# EAGLE design pololuLaserDrv (EAGLE 7.0.0)
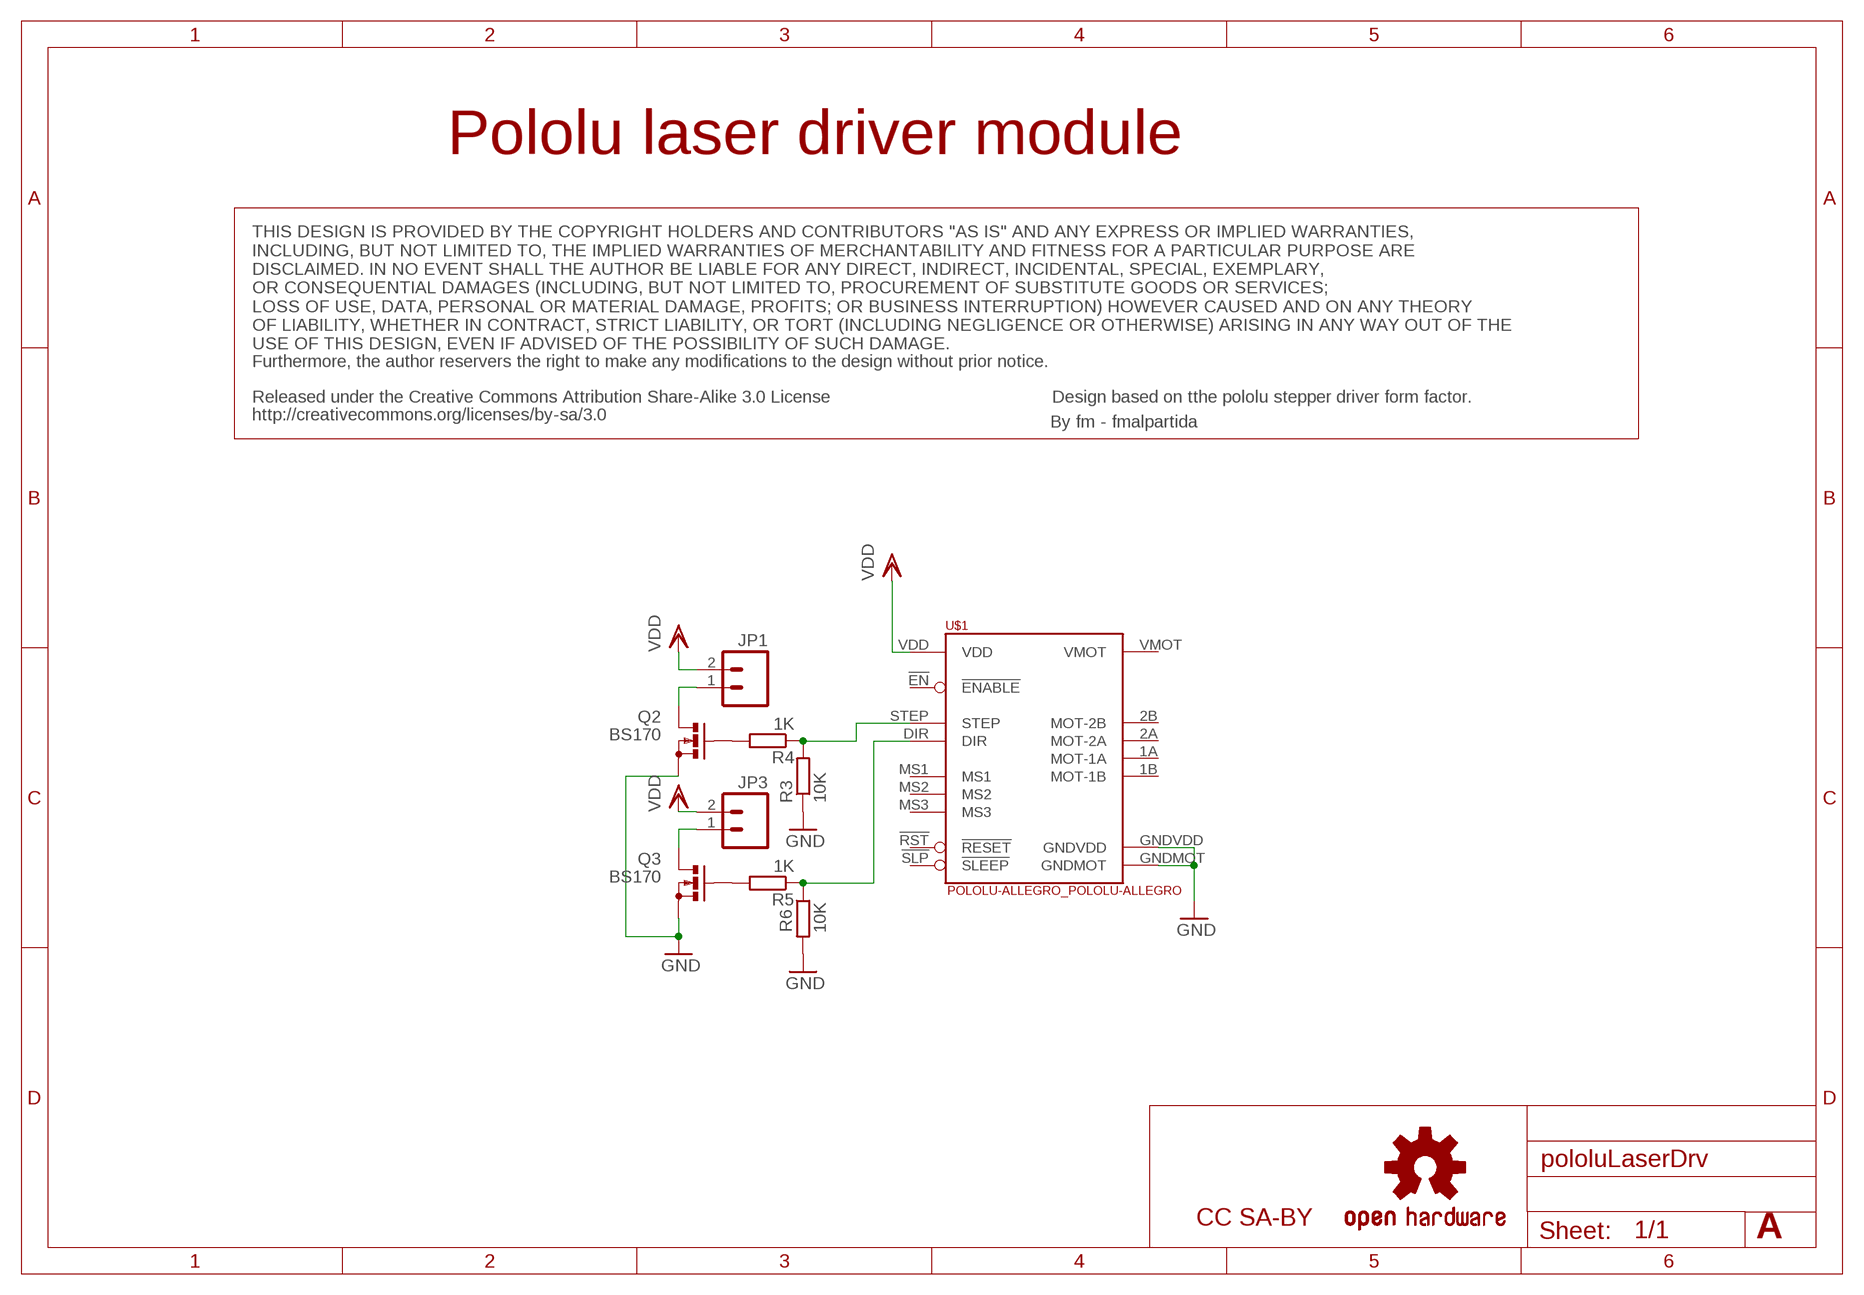
[diagram p0: schematic, sheet 1]

## Parts
JP1  M02PTH  [1X02]
JP3  M02PTH  [1X02]
Q2  BS170  [SOT54E]
Q3  BS170  [SOT54E]
R3  10K  R-EU_0204/5  [0204/5]
R4  1K  R-EU_0204/5  [0204/5]
R5  1K  R-EU_0204/5  [0204/5]
R6  10K  R-EU_0204/5  [0204/5]
U$1  POLOLU-ALLEGRO_POLOLU-ALLEGRO  [POLOLU-ALLEGRO_POLOLU-ALLEGRO-PTH]
U$2  OSHW-LOGOS  [OSHW-LOGO-S]

## Nets
GND: Q2.S Q3.S R3.1 R6.2 U$1.GNDMOT U$1.GNDVDD
N$4: Q2.G R4.2
N$5: R3.2 R4.1 U$1.STEP
N$6: Q3.G R5.2
N$7: R5.1 R6.1 U$1.DIR
N$9: JP1.1 Q2.D
N$10: JP3.1 Q3.D
VDD: JP1.2 JP3.2 U$1.VDD
Unconnected: U$1.!EN(!ENABLE) U$1.!RST(!RESET) U$1.!SLP(!SLEEP) U$1.MS1 U$1.MS2 U$1.MS3

## Notes on the sheet
- Pololu laser driver module
- THIS DESIGN IS PROVIDED BY THE COPYRIGHT HOLDERS AND CONTRIBUTORS "AS IS" AND ANY EXPRESS OR IMPLIED WARRANTIES, 
  INCLUDING, BUT NOT LIMITED TO, THE IMPLIED WARRANTIES OF MERCHANTABILITY AND FITNESS FOR A PARTICULAR PURPOSE ARE
  DISCLAIMED. IN NO EVENT SHALL THE AUTHOR BE LIABLE FOR ANY DIRECT, INDIRECT, INCIDENTAL, SPECIAL, EXEMPLARY, 
  OR CONSEQUENTIAL DAMAGES (INCLUDING, BUT NOT LIMITED TO, PROCUREMENT OF SUBSTITUTE GOODS OR SERVICES;
  LOSS OF USE, DATA, PERSONAL OR MATERIAL DAMAGE, PROFITS; OR BUSINESS INTERRUPTION) HOWEVER CAUSED AND ON ANY THEORY 
  OF LIABILITY, WHETHER IN CONTRACT, STRICT LIABILITY, OR TORT (INCLUDING NEGLIGENCE OR OTHERWISE) ARISING IN ANY WAY OUT OF THE 
  USE OF THIS DESIGN, EVEN IF ADVISED OF THE POSSIBILITY OF SUCH DAMAGE.
- Furthermore, the author reservers the right to make any modifications to the design without prior notice.
- Released under the Creative Commons Attribution Share-Alike 3.0 License | Design based on tthe pololu stepper driver form factor.
- http://creativecommons.org/licenses/by-sa/3.0
- By fm - fmalpartida
- CC SA-BY
- A

## Power pins joined to a net without a drawn wire
MOT-1A: U$1.1A(MOT-1A)
MOT-1B: U$1.1B(MOT-1B)
MOT-2A: U$1.2A(MOT-2A)
MOT-2B: U$1.2B(MOT-2B)
VMOT: U$1.VMOT

## Library data of the parts
JP1 JP3 = SparkFun:M02: Header 2 Standard 2-pin 0.1" header. Use with straight break away headers (SKU : PRT-00116), right angle break away headers (PRT-00553), swiss pins (PRT-00743), machine pins (PRT-00117), and female headers (PRT-00115). Molex polarized connector foot print use with SKU : PRT-08233 with associated crimp pins and housings.
Q2 Q3 = transistor-small-signal:BS170: N-CHANNEL MOS FET
R3-R6 = rcl:R-EU_: RESISTOR, European symbol
U$1 = SAVLibSAV MK-I:POLOLU-ALLEGRO_POLOLU-ALLEGRO
U$2 = SparkFun:OSHW-LOGO: Open Source Hardware Logo This logo indicates the piece of hardware it is found on incorporates a OSHW license and/or adheres to the definition of open source hardware found here: http://freedomdefined.org/OSHW

## Board
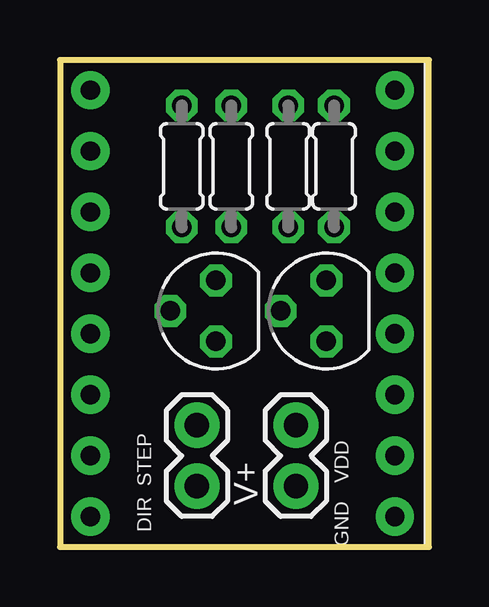
[diagram p1: board, top side]
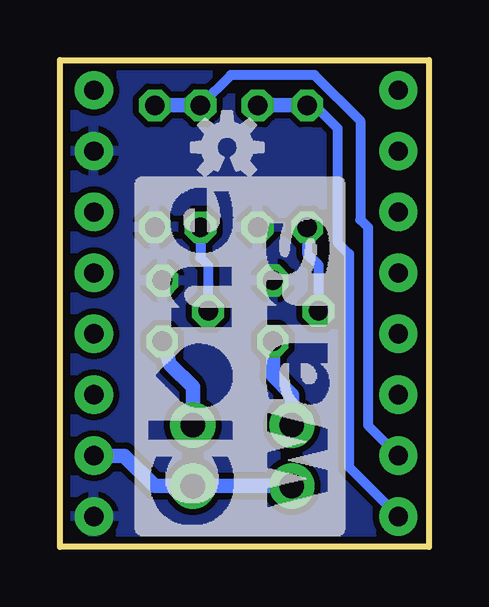
[diagram p2: board, bottom side, seen from below]

Size 15.39 x 20.31 mm. Coordinates in mm from the lower left corner, seen from the top.
Outline: 0,0 15.39,0 15.39,20.31 0,20.31 0,0
Copper layers (1*16): Top 0.035mm / dielectric 1.5mm / Bottom 0.035mm
Design rules "default *": minimum track width 10mil, minimum drill 24mil, track to track 10mil, track to pad 10mil, pad to pad 10mil, via to via 10mil, smd to smd 10mil, copper to edge 12mil, drill to drill 8mil, minimum pad ring 10mil, minimum via ring 8mil, stop-mask expansion 4mil, vias tented up to drill 0mil, thermal gap 10mil

### Footprints (pad centres in the part's own frame; a part is rotated, then mirrored left to right if it is on the bottom)
1X02 = drill 1.016 pad 1.88: 1 0,0; 2 2.54,0
SOT54E = drill 0.813 octagon: D -1.27,0; G 0,1.905; S 1.27,0
0204/5 = drill 0.813 octagon: 1 -2.54,0; 2 2.54,0
POLOLU-ALLEGRO_POLOLU-ALLEGRO-PTH = drill 0.8 pad 1.6: 1A 6.35,-1.27; 1B 6.35,-3.81; 2A 6.35,1.27; 2B 6.35,3.81; !EN -6.35,8.89; !RST -6.35,-1.27; !SLP -6.35,-3.81; DIR -6.35,-8.89; GNDMOT 6.35,6.35; GNDVDD 6.35,-8.89; MS1 -6.35,6.35; MS2 -6.35,3.81; MS3 -6.35,1.27; STEP -6.35,-6.35; VDD 6.35,-6.35; VMOT 6.35,8.89

### Placement (x,y rotation side)
JP1  9.84,5.08 270 top
JP3  5.71,5.08 270 top
Q2  11.11,9.84 90 top
Q3  6.51,9.84 90 top
R3  11.43,15.88 90 top
R4  9.53,15.88 270 top
R5  5.08,15.88 270 top
R6  7.14,15.88 270 top
U$1  7.62,10.16 0 top
U$2  8.41,16.67 0 bottom
U$3  [CLONE_WARS]  3.49,0.48 90 bottom

### Tracks (layer width: path | path; a pad name or v marks a point on that pad's centre or on a via)
GND
  pour Bottom: 0,20.32 15.24,20.32 15.24,0 0,0
N$4
  Bottom 0.406: R4.2 9.53,12.06 9.21,11.75 Q2.G
N$5
  Bottom 0.406: U$1.STEP 2.54,5.08 2.54,13.34 2.86,13.65 2.86,17.78 4.76,19.68 8.26,19.68 R4.1
  Bottom 0.61: R4.1 R3.2
N$6
  Bottom 0.406: R5.2 5.08,12.22 4.6,11.75 Q3.G
N$7
  Bottom 0.406: R5.1 4.76,18.41 3.81,17.46 3.81,12.7 3.33,12.22 3.33,3.33 U$1.DIR
  Bottom 0.61: R5.1 R6.1
N$9
  Bottom 0.61: Q2.D 10.79,7.62 9.84,6.67 JP1.1
N$10
  Bottom 0.61: Q3.D 6.51,7.14 5.71,6.35 JP3.1
VDD
  Bottom 0.61: U$1.VDD 12.7,3.81 11.43,2.54 JP1.2 JP3.2

### Text on the board
tNames: V+